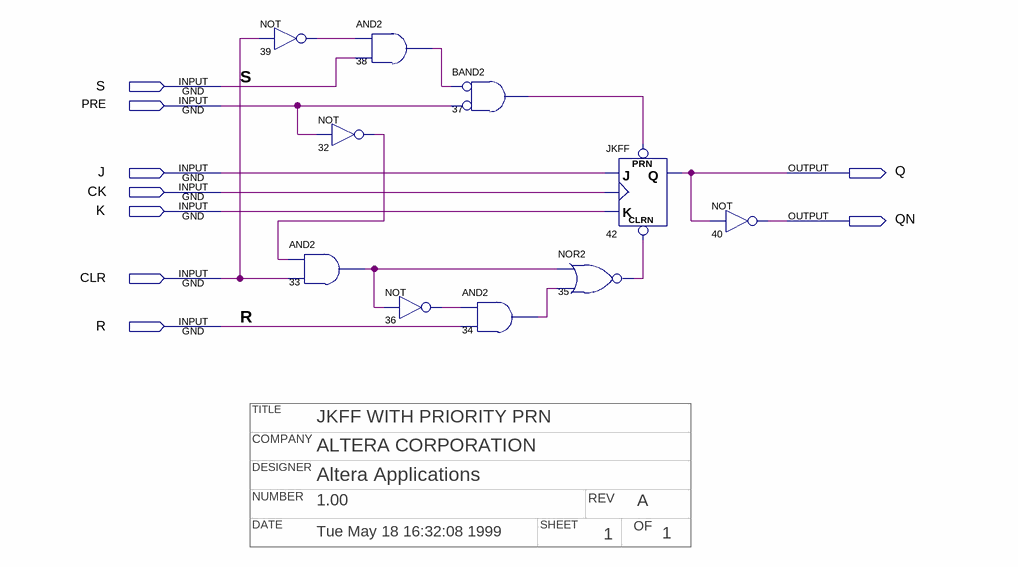
[diagram p0: schematic sheet]
// Quartus schematic ujkff.bdf as structural Verilog: 10 symbols, 9 pins
// Title block: TITLE: JKFF WITH PRIORITY PRN; COMPANY: ALTERA CORPORATION; DESIGNER: Altera Applications; NUMBER: 1.00; REV: A; DATE: Tue May 18 16:32:08 1999; SHEET: 1; OF: 1
module ujkff (
  input  S,
  input  PRE,
  input  J,
  input  CK,
  input  K,
  input  CLR,
  input  R,
  output Q,
  output QN
);

  wire n32_out, n33_out, n34_out, n35_out, n36_out, n37_out, n38_out, n39_out;

  not u_39 (n39_out, CLR);
  and u_38 (n38_out, n39_out, S);
  not u_32 (n32_out, PRE);
  and u_33 (n33_out, n32_out, CLR);
  not u_36 (n36_out, n33_out);
  and u_37 (n37_out, ~n38_out, ~PRE);  // BAND2
  and u_34 (n34_out, n36_out, R);
  nor u_35 (n35_out, n33_out, n34_out);
  JKFF u_42 (.PRN(n37_out), .CLRN(n35_out), .K(K), .J(J), .CLK(CK), .Q(Q));
  not u_40 (QN, Q);
endmodule
